# Altium schematic sheet Breakout_Connector.SchDoc
size A4; PageSetup: Record=PageOptions|CenterHorizontal=True|CenterVertical=True|PrintScale=0.92|XCorrection=1.00|YCorrection=1.00|PrintKind=0|BorderSize=5000000|LeftOffset=0|BottomOffset=0|Orientation=2|PaperLength=1000|PaperWidth=1000|Scale=100|PaperSource=7|PrintQuality=-4|MediaType=1|DitherType=10|PrintScaleMode=1|PaperKind=A4; CompanyName: Technische Hochschule Nürnberg Georg Simon Ohm; Organization: UltraZohm; Address1: Kesslerplatz 12; Address2: 90489 Nürnberg; Address3: GERMANY; DocumentNumber: 3; SheetNumber: 3; SheetTotal: 5; Website: www.ultrazohm.com
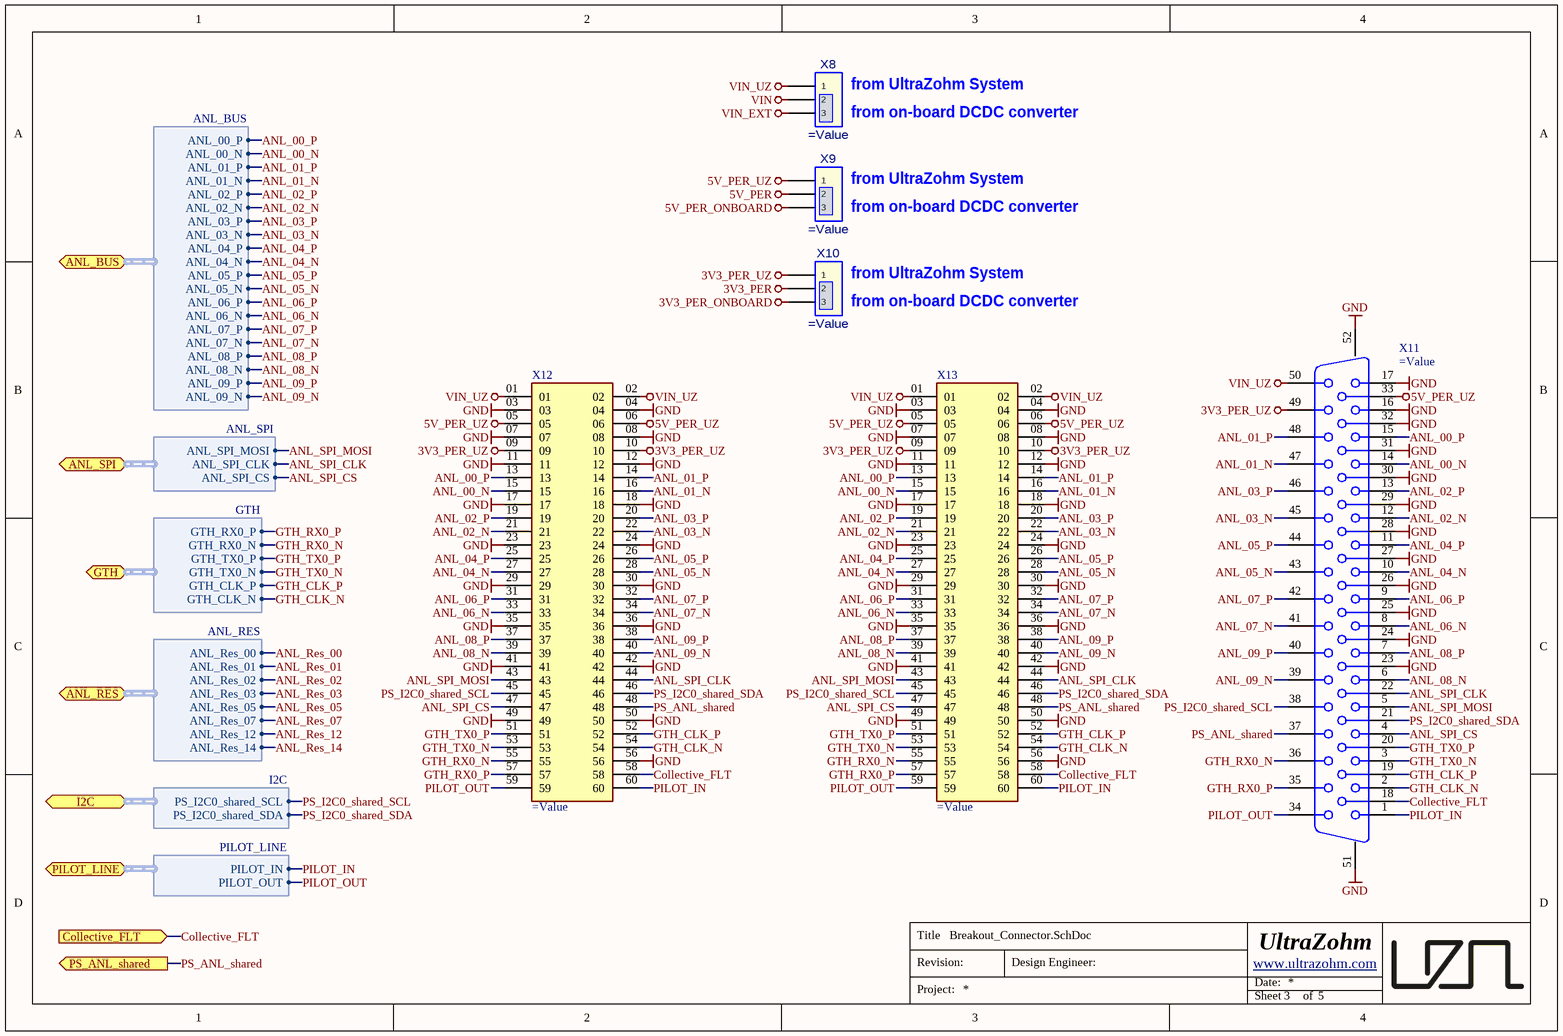
[diagram p0: Breakout_Connector.SchDoc]

## Parts
X8  (no value)  [TSW-103-XX-XXX-S]
X9  (no value)  [TSW-103-XX-XXX-S]
X10  (no value)  [TSW-103-XX-XXX-S]
X11  (no value)  [dsub50_female_164A18759X]
X12  (no value)  [TSM-130-01-F-DV]
X13  (no value)  [HTSS-130-01-L-DV]

## Ports
ANL_BUS (bidir, harness ANL_BUS), ANL_RES (bidir, harness ANL_RES), ANL_SPI (bidir, harness ANL_SPI), Collective_FLT (in), GTH (bidir, harness GTH), I2C (bidir, harness I2C), PILOT_LINE (bidir, harness PILOT_LINE), PS_ANL_shared (out)

## Harnesses
I2C: PS_I2C0_shared_SDA, PS_I2C0_shared_SCL
PILOT_LINE: PILOT_OUT, PILOT_IN
ANL_BUS: ANL_00_P, ANL_00_N, ANL_01_P, ANL_01_N, ANL_02_P, ANL_02_N, ANL_03_P, ANL_03_N, ANL_04_P, ANL_04_N, ANL_05_P, ANL_05_N, ANL_06_P, ANL_06_N, ANL_07_P, ANL_07_N, ANL_08_P, ANL_08_N, ANL_09_P, ANL_09_N
ANL_RES: ANL_Res_00, ANL_Res_01, ANL_Res_02, ANL_Res_03, ANL_Res_05, ANL_Res_07, ANL_Res_12, ANL_Res_14
GTH: GTH_RX0_P, GTH_RX0_N, GTH_TX0_P, GTH_TX0_N, GTH_CLK_P, GTH_CLK_N
ANL_SPI: ANL_SPI_MOSI, ANL_SPI_CLK, ANL_SPI_CS

## Nets
3V3_PER: X10.2
3V3_PER_ONBOARD: X10.3
3V3_PER_UZ: X10.1 X11.49 X12.09 X12.10 X13.09 X13.10
5V_PER: X9.2
5V_PER_ONBOARD: X9.3
5V_PER_UZ: X9.1 X11.33 X12.05 X12.06 X13.05 X13.06
GND: X11.16 X11.17 X11.23 X11.24 X11.25 X11.26 X11.27 X11.28 X11.29 X11.30 X11.31 X11.32 X11.51 X11.52 X12.03 X12.04 X12.07 X12.08 X12.11 X12.12 X12.17 X12.18 X12.23 X12.24 X12.29 X12.30 X12.35 X12.36 X12.41 X12.42 X12.49 X12.50 X12.56 X13.03 X13.04 X13.07 X13.08 X13.11 X13.12 X13.17 X13.18 X13.23 X13.24 X13.29 X13.30 X13.35 X13.36 X13.41 X13.42 X13.49 X13.50 X13.56
VIN: X8.2
VIN_EXT: X8.3
VIN_UZ: X8.1 X11.50 X12.01 X12.02 X13.01 X13.02
ANL_00_N: X11.14 X12.15 X13.15 ; port ANL_BUS.ANL_00_N
ANL_00_P: X11.15 X12.13 X13.13 ; port ANL_BUS.ANL_00_P
ANL_01_N: X11.47 X12.16 X13.16 ; port ANL_BUS.ANL_01_N
ANL_01_P: X11.48 X12.14 X13.14 ; port ANL_BUS.ANL_01_P
ANL_02_N: X11.12 X12.21 X13.21 ; port ANL_BUS.ANL_02_N
ANL_02_P: X11.13 X12.19 X13.19 ; port ANL_BUS.ANL_02_P
ANL_03_N: X11.45 X12.22 X13.22 ; port ANL_BUS.ANL_03_N
ANL_03_P: X11.46 X12.20 X13.20 ; port ANL_BUS.ANL_03_P
ANL_04_N: X11.10 X12.27 X13.27 ; port ANL_BUS.ANL_04_N
ANL_04_P: X11.11 X12.25 X13.25 ; port ANL_BUS.ANL_04_P
ANL_05_N: X11.43 X12.28 X13.28 ; port ANL_BUS.ANL_05_N
ANL_05_P: X11.44 X12.26 X13.26 ; port ANL_BUS.ANL_05_P
ANL_06_N: X11.8 X12.33 X13.33 ; port ANL_BUS.ANL_06_N
ANL_06_P: X11.9 X12.31 X13.31 ; port ANL_BUS.ANL_06_P
ANL_07_N: X11.41 X12.34 X13.34 ; port ANL_BUS.ANL_07_N
ANL_07_P: X11.42 X12.32 X13.32 ; port ANL_BUS.ANL_07_P
ANL_08_N: X11.6 X12.39 X13.39 ; port ANL_BUS.ANL_08_N
ANL_08_P: X11.7 X12.37 X13.37 ; port ANL_BUS.ANL_08_P
ANL_09_N: X11.39 X12.40 X13.40 ; port ANL_BUS.ANL_09_N
ANL_09_P: X11.40 X12.38 X13.38 ; port ANL_BUS.ANL_09_P
ANL_Res_00: port ANL_RES.ANL_Res_00
ANL_Res_01: port ANL_RES.ANL_Res_01
ANL_Res_02: port ANL_RES.ANL_Res_02
ANL_Res_03: port ANL_RES.ANL_Res_03
ANL_Res_05: port ANL_RES.ANL_Res_05
ANL_Res_07: port ANL_RES.ANL_Res_07
ANL_Res_12: port ANL_RES.ANL_Res_12
ANL_Res_14: port ANL_RES.ANL_Res_14
ANL_SPI_CLK: X11.22 X12.44 X13.44 ; port ANL_SPI.ANL_SPI_CLK
ANL_SPI_CS: X11.4 X12.47 X13.47 ; port ANL_SPI.ANL_SPI_CS
ANL_SPI_MOSI: X11.5 X12.43 X13.43 ; port ANL_SPI.ANL_SPI_MOSI
Collective_FLT: X11.18 X12.58 X13.58 ; port Collective_FLT
GTH_CLK_N: X11.2 X12.54 X13.54 ; port GTH.GTH_CLK_N
GTH_CLK_P: X11.19 X12.52 X13.52 ; port GTH.GTH_CLK_P
GTH_RX0_N: X11.36 X12.55 X13.55 ; port GTH.GTH_RX0_N
GTH_RX0_P: X11.35 X12.57 X13.57 ; port GTH.GTH_RX0_P
GTH_TX0_N: X11.3 X12.53 X13.53 ; port GTH.GTH_TX0_N
GTH_TX0_P: X11.20 X12.51 X13.51 ; port GTH.GTH_TX0_P
PILOT_IN: X11.1 X12.60 X13.60 ; port PILOT_LINE.PILOT_IN
PILOT_OUT: X11.34 X12.59 X13.59 ; port PILOT_LINE.PILOT_OUT
PS_ANL_shared: X11.37 X12.48 X13.48 ; port PS_ANL_shared
PS_I2C0_shared_SCL: X11.38 X12.45 X13.45 ; port I2C.PS_I2C0_shared_SCL
PS_I2C0_shared_SDA: X11.21 X12.46 X13.46 ; port I2C.PS_I2C0_shared_SDA

## Notes on the sheet
- (near X8) from UltraZohm System
- (near X8) from on-board DCDC converter
- (near X9) from UltraZohm System
- (near X9) from on-board DCDC converter
- (near X10) from UltraZohm System
- (near X10) from on-board DCDC converter
- Title
- Revision:
- Design Engineer:
- Date:
- Project:
- Sheet
- of

## Library data of the parts
X8-X10 = TSW-103-XX-XXX-S: .025[0.64] SQ. POST TERMINAL STRIP ASSEMBLY.; Manufacturer: SAMTEC; MPN: TSW-103-07-F-S; Value: TSW-103-07-F-S; Created: 2020_11_26_AGeiger
X11 = DSUB50_female: D-SUB, female, right angle, 50pos, 9.4mm pitch; MPN: 164A18759X; MF: CONEC; Value: 164A18759X; Supplier Part Number 1: D-SUB BU 50GWC; ComponentLink1Description: Datasheet; ComponentLink1URL: http://www.conec.com/catalog/media/conec/DRAWINGS/164A18759X.pdf; Supplier Part Number 2: 706-164A18759X; Supplier 1: Reichelt; Supplier 2: Mouser; Supplier 3: Digi-Key; Supplier Part Number 3: 164A18759X-ND; Created: 2019_10_24_AGeiger
X12 = TSM-130-01-F-DV: MF: Samtec; MPN: TSM-130-01-F-DV; Value: TSM-130-01-F-DV; Created: 2021_03_23_AGeiger
X13 = HTSS-130-01-L-DV: MF: SAMTEC; Value: HTSS-130-01-L-DV; MPN: HTSS-130-01-L-DV